# Altium schematic sheet AC_Board.SchDoc
size A; SheetNumber: 2; SheetTotal: 2
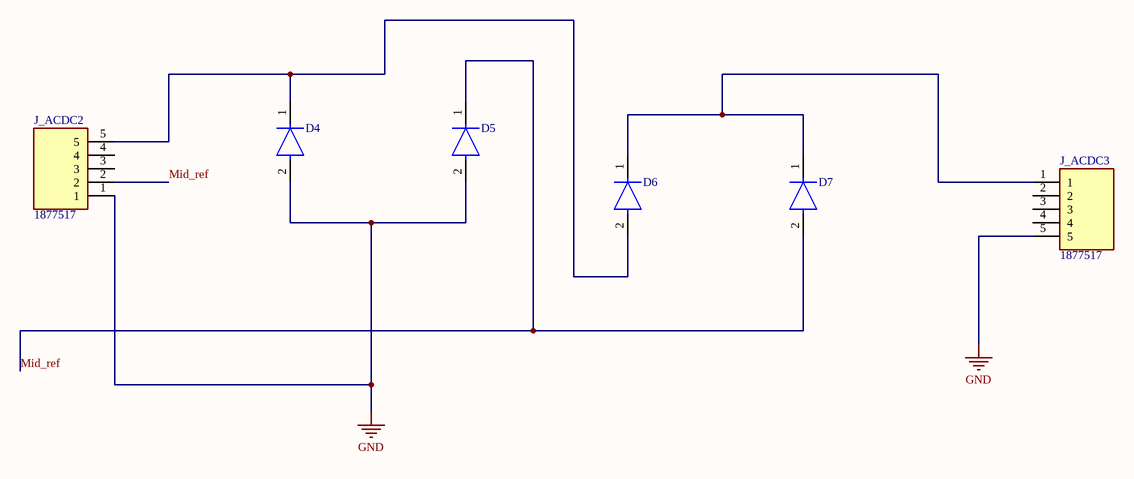
[diagram p0: AC_Board.SchDoc]

## Parts
D4  S8MC-13  [FP-SMC-MFG]  (value not drawn)
D5  S8MC-13  [FP-SMC-MFG]  (value not drawn)
D6  S8MC-13  [FP-SMC-MFG]  (value not drawn)
D7  S8MC-13  [FP-SMC-MFG]  (value not drawn)
J_ACDC2  1877517  [1877517]
J_ACDC3  1877517  [1877517]

## Nets
GND: D4.2(A) D5.2(A) J_ACDC2.1 J_ACDC3.5
Mid_ref: D5.1(C) D7.2(A) J_ACDC2.2
NetD4_1: D4.1(C) D6.2(A) J_ACDC2.5
NetD6_1: D6.1(C) D7.1(C) J_ACDC3.1

Not connected (* = marked no-connect by the designer): J_ACDC2 3 4; J_ACDC3 2 3 4

## Library data of the parts
D4-D7 = CMP-12791-000060-1: DIODE GEN PURP 1KV 8A SMC; Peak Non-Repetitive Surge Current: 200A; Max Reverse Current: 10uA; Element Configuration: Single; Forward Voltage: 985mV; RoHS Compliant: Yes; Min Operating Temperature: -65°C; Number of Pins: 2; Max Forward Surge Current (Ifsm): 200A; Series: -; Reverse Voltage (DC): 1kV; Height: 2.42mm; Package Quantity: 3000; Average Rectified Current: 8A; Max Reverse Voltage (DC): 1kV; Packaging: Tape and Reel; Max Operating Temperature: 150°C; Forward Current: 8A; Lead Free: Lead Free; Max Surge Current: 200A; Mount: Surface Mount; Case/Package: SMC; Contact Plating: Tin; Length: 7.11mm; Radiation Hardening: No; Width: 6.22mm; Max Repetitive Reverse Voltage (Vrrm): 1kV; Weight: 0.007408oz
J_ACDC2 J_ACDC3 = 1877517: Connector; Manufacturer_Name: Phoenix Contact; Datasheet Link: http://www.phoenixcontact.com/de/produkte/1877517/pdf; Height: 11.15mm; Manufacturer_Part_Number: 1877517; Mouser Part Number: 651-1877517; Mouser Price/Stock: https://www.mouser.co.uk/ProductDetail/Phoenix-Contact/1877517?qs=oNl2diMeDgawHeYJ1eCJiQ%3D%3D